# EAGLE design Front-End (EAGLE 8.3.2)

## Sheet 1 of 3
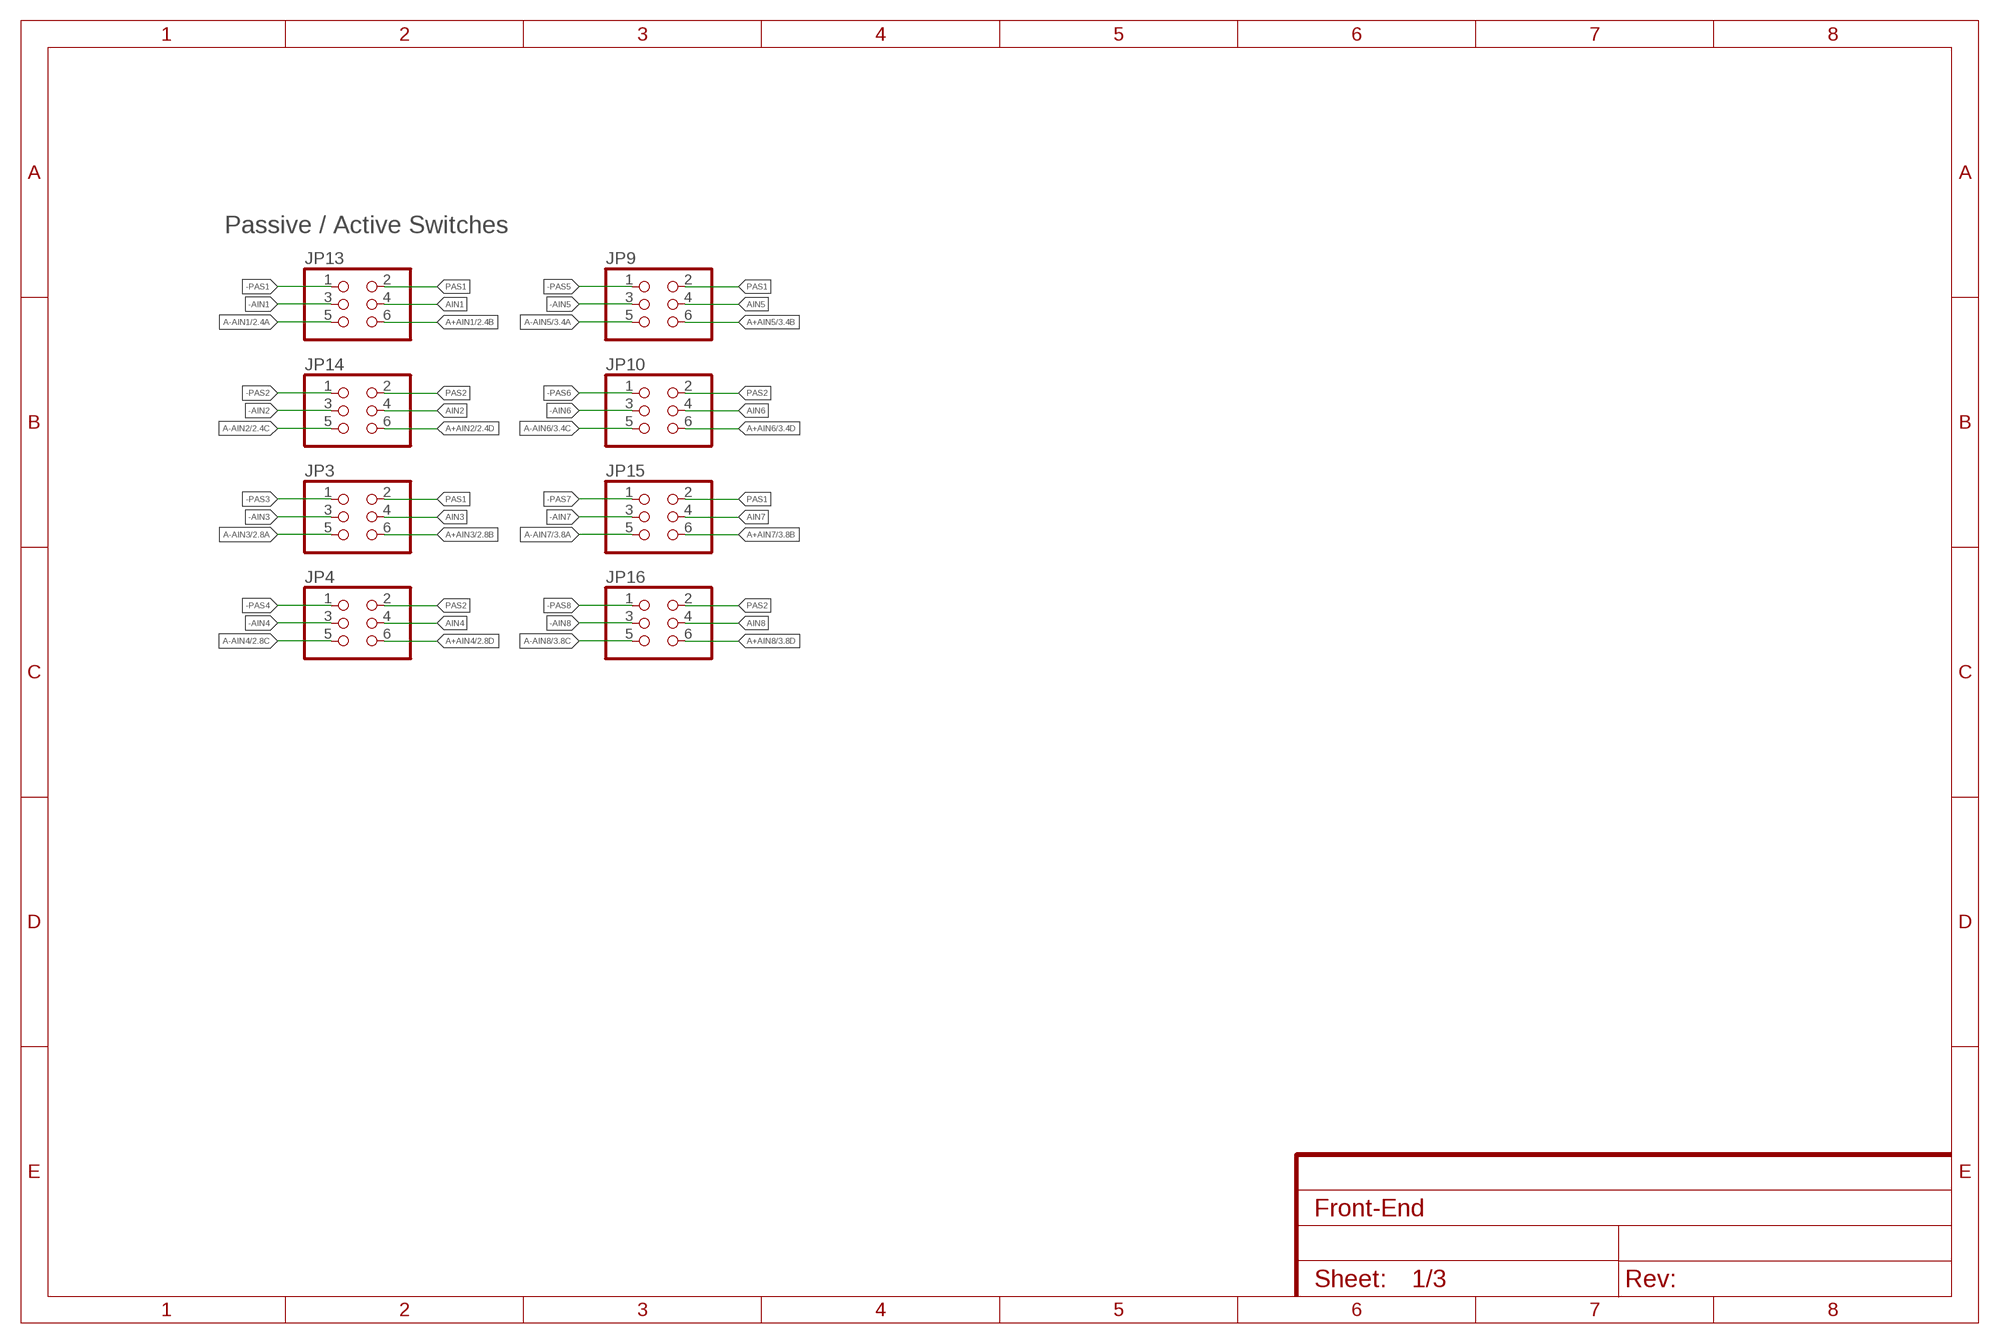
[diagram p0: schematic, sheet 1]

### Parts
JP3  PINHD-2X3  [2X03]
JP4  PINHD-2X3  [2X03]
JP9  PINHD-2X3  [2X03]
JP10  PINHD-2X3  [2X03]
JP13  PINHD-2X3  [2X03]
JP14  PINHD-2X3  [2X03]
JP15  PINHD-2X3  [2X03]
JP16  PINHD-2X3  [2X03]

### Nets
-AIN1: JP13.3
-AIN2: JP14.3
-AIN3: JP3.3
-AIN4: JP4.3
-AIN5: JP9.3
-AIN6: JP10.3
-AIN7: JP15.3
-AIN8: JP16.3
-PAS1: JP13.1 ; also sheet 2
-PAS2: JP14.1 ; also sheet 2
-PAS3: JP3.1 ; also sheet 2
-PAS4: JP4.1 ; also sheet 2
-PAS5: JP9.1 ; also sheet 3
-PAS6: JP10.1 ; also sheet 3
-PAS7: JP15.1 ; also sheet 3
-PAS8: JP16.1 ; also sheet 3
A+AIN1: JP13.6 ; also sheet 2
A+AIN2: JP14.6 ; also sheet 2
A+AIN3: JP3.6 ; also sheet 2
A+AIN4: JP4.6 ; also sheet 2
A+AIN5: JP9.6 ; also sheet 3
A+AIN6: JP10.6 ; also sheet 3
A+AIN7: JP15.6 ; also sheet 3
A+AIN8: JP16.6 ; also sheet 3
A-AIN1: JP13.5 ; also sheet 2
A-AIN2: JP14.5 ; also sheet 2
A-AIN3: JP3.5 ; also sheet 2
A-AIN4: JP4.5 ; also sheet 2
A-AIN5: JP9.5 ; also sheet 3
A-AIN6: JP10.5 ; also sheet 3
A-AIN7: JP15.5 ; also sheet 3
A-AIN8: JP16.5 ; also sheet 3
AIN1: JP13.4
AIN2: JP14.4
AIN3: JP3.4
AIN4: JP4.4
AIN5: JP9.4
AIN6: JP10.4
AIN7: JP15.4
AIN8: JP16.4
PAS1: JP3.2 JP9.2 JP13.2 JP15.2 ; also sheet 2,3
PAS2: JP4.2 JP10.2 JP14.2 JP16.2 ; also sheet 2,3

### Notes on the sheet
- Passive / Active Switches

## Sheet 2 of 3
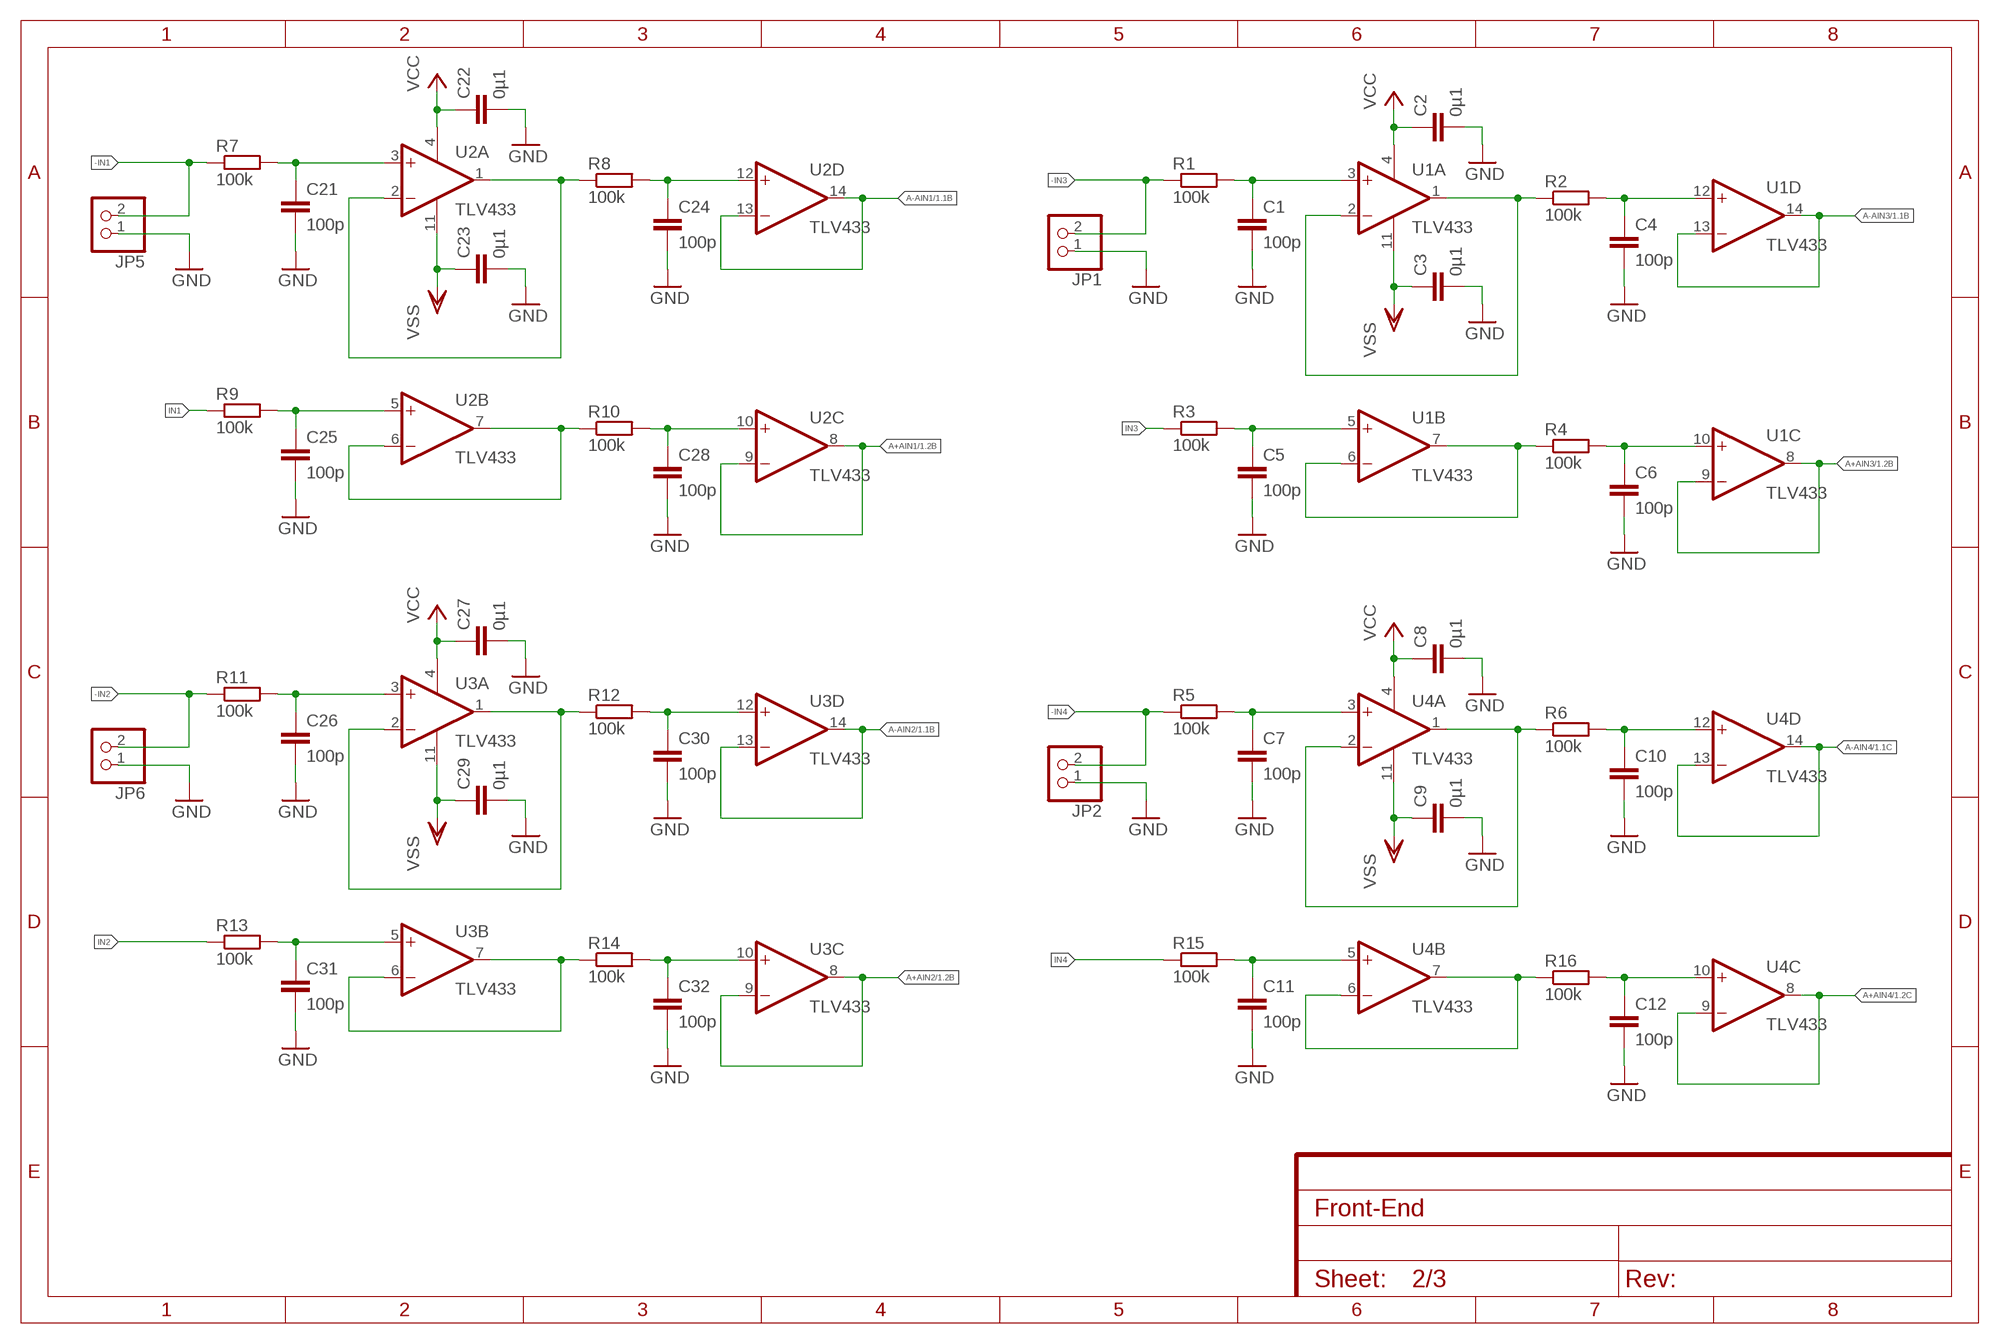
[diagram p1: schematic, sheet 2]

### Parts
C1  100p  C-EUC0603  [C0603]
C2  0µ1  C-EUC0603  [C0603]
C3  0µ1  C-EUC0603  [C0603]
C4  100p  C-EUC0603  [C0603]
C5  100p  C-EUC0603  [C0603]
C6  100p  C-EUC0603  [C0603]
C7  100p  C-EUC0603  [C0603]
C8  0µ1  C-EUC0603  [C0603]
C9  0µ1  C-EUC0603  [C0603]
C10  100p  C-EUC0603  [C0603]
C11  100p  C-EUC0603  [C0603]
C12  100p  C-EUC0603  [C0603]
C21  100p  C-EUC0603  [C0603]
C22  0µ1  C-EUC0603  [C0603]
C23  0µ1  C-EUC0603  [C0603]
C24  100p  C-EUC0603  [C0603]
C25  100p  C-EUC0603  [C0603]
C26  100p  C-EUC0603  [C0603]
C27  0µ1  C-EUC0603  [C0603]
C28  100p  C-EUC0603  [C0603]
C29  0µ1  C-EUC0603  [C0603]
C30  100p  C-EUC0603  [C0603]
C31  100p  C-EUC0603  [C0603]
C32  100p  C-EUC0603  [C0603]
JP1  PINHD-1X2  [1X02]
JP2  PINHD-1X2  [1X02]
JP5  PINHD-1X2  [1X02]
JP6  PINHD-1X2  [1X02]
R1  100k  R-EU_R0603  [R0603]
R2  100k  R-EU_R0603  [R0603]
R3  100k  R-EU_R0603  [R0603]
R4  100k  R-EU_R0603  [R0603]
R5  100k  R-EU_R0603  [R0603]
R6  100k  R-EU_R0603  [R0603]
R7  100k  R-EU_R0603  [R0603]
R8  100k  R-EU_R0603  [R0603]
R9  100k  R-EU_R0603  [R0603]
R10  100k  R-EU_R0603  [R0603]
R11  100k  R-EU_R0603  [R0603]
R12  100k  R-EU_R0603  [R0603]
R13  100k  R-EU_R0603  [R0603]
R14  100k  R-EU_R0603  [R0603]
R15  100k  R-EU_R0603  [R0603]
R16  100k  R-EU_R0603  [R0603]
U1  TLV433  [TSSOP14]
U2  TLV433  [TSSOP14]
U3  TLV433  [TSSOP14]
U4  TLV433  [TSSOP14]

### Nets
-IN1: JP5.2 R7.1
-IN2: JP6.2 R11.1
-IN3: JP1.2 R1.1
-IN4: JP2.2 R5.1
-PAS1: C21.1 R7.2 U2.3(A:+IN) ; also sheet 1
-PAS2: C26.1 R11.2 U3.3(A:+IN) ; also sheet 1
-PAS3: C1.1 R1.2 U1.3(A:+IN) ; also sheet 1
-PAS4: C7.1 R5.2 U4.3(A:+IN) ; also sheet 1
A+AIN1: U2.8(C:OUT) U2.9(C:-IN) ; also sheet 1
A+AIN2: U3.8(C:OUT) U3.9(C:-IN) ; also sheet 1
A+AIN3: U1.8(C:OUT) U1.9(C:-IN) ; also sheet 1
A+AIN4: U4.8(C:OUT) U4.9(C:-IN) ; also sheet 1
A-AIN1: U2.13(D:-IN) U2.14(D:OUT) ; also sheet 1
A-AIN2: U3.13(D:-IN) U3.14(D:OUT) ; also sheet 1
A-AIN3: U1.13(D:-IN) U1.14(D:OUT) ; also sheet 1
A-AIN4: U4.13(D:-IN) U4.14(D:OUT) ; also sheet 1
GND: C1.2 C2.2 C3.2 C4.2 C5.2 C6.2 C7.2 C8.2 C9.2 C10.2 C11.2 C12.2 C21.2 C22.2 C23.2 C24.2 C25.2 C26.2 C27.2 C28.2 C29.2 C30.2 C31.2 C32.2 JP1.1 JP2.1 JP5.1 JP6.1 ; also sheet 3
IN1: R9.1
IN2: R13.1
IN3: R3.1
IN4: R15.1
N$1: C4.1 R2.2 U1.12(D:+IN)
N$2: R2.1 U1.1(A:OUT) U1.2(A:-IN)
N$3: C6.1 R4.2 U1.10(C:+IN)
N$4: C28.1 R10.2 U2.10(C:+IN)
N$5: C24.1 R8.2 U2.12(D:+IN)
N$6: R8.1 U2.1(A:OUT) U2.2(A:-IN)
N$7: R10.1 U2.6(B:-IN) U2.7(B:OUT)
N$8: R4.1 U1.6(B:-IN) U1.7(B:OUT)
N$9: C30.1 R12.2 U3.12(D:+IN)
N$10: R12.1 U3.1(A:OUT) U3.2(A:-IN)
N$11: C10.1 R6.2 U4.12(D:+IN)
N$12: C32.1 R14.2 U3.10(C:+IN)
N$13: R14.1 U3.6(B:-IN) U3.7(B:OUT)
N$206: R6.1 U4.1(A:OUT) U4.2(A:-IN)
N$207: C12.1 R16.2 U4.10(C:+IN)
N$208: R16.1 U4.6(B:-IN) U4.7(B:OUT)
PAS1: C5.1 C25.1 R3.2 R9.2 U1.5(B:+IN) U2.5(B:+IN) ; also sheet 1,3
PAS2: C11.1 C31.1 R13.2 R15.2 U3.5(B:+IN) U4.5(B:+IN) ; also sheet 1,3
VCC: C2.1 C8.1 C22.1 C27.1 U1.4(A:V+) U2.4(A:V+) U3.4(A:V+) U4.4(A:V+) ; also sheet 3
VSS: C3.1 C9.1 C23.1 C29.1 U1.11(A:V-) U2.11(A:V-) U3.11(A:V-) U4.11(A:V-) ; also sheet 3

## Sheet 3 of 3
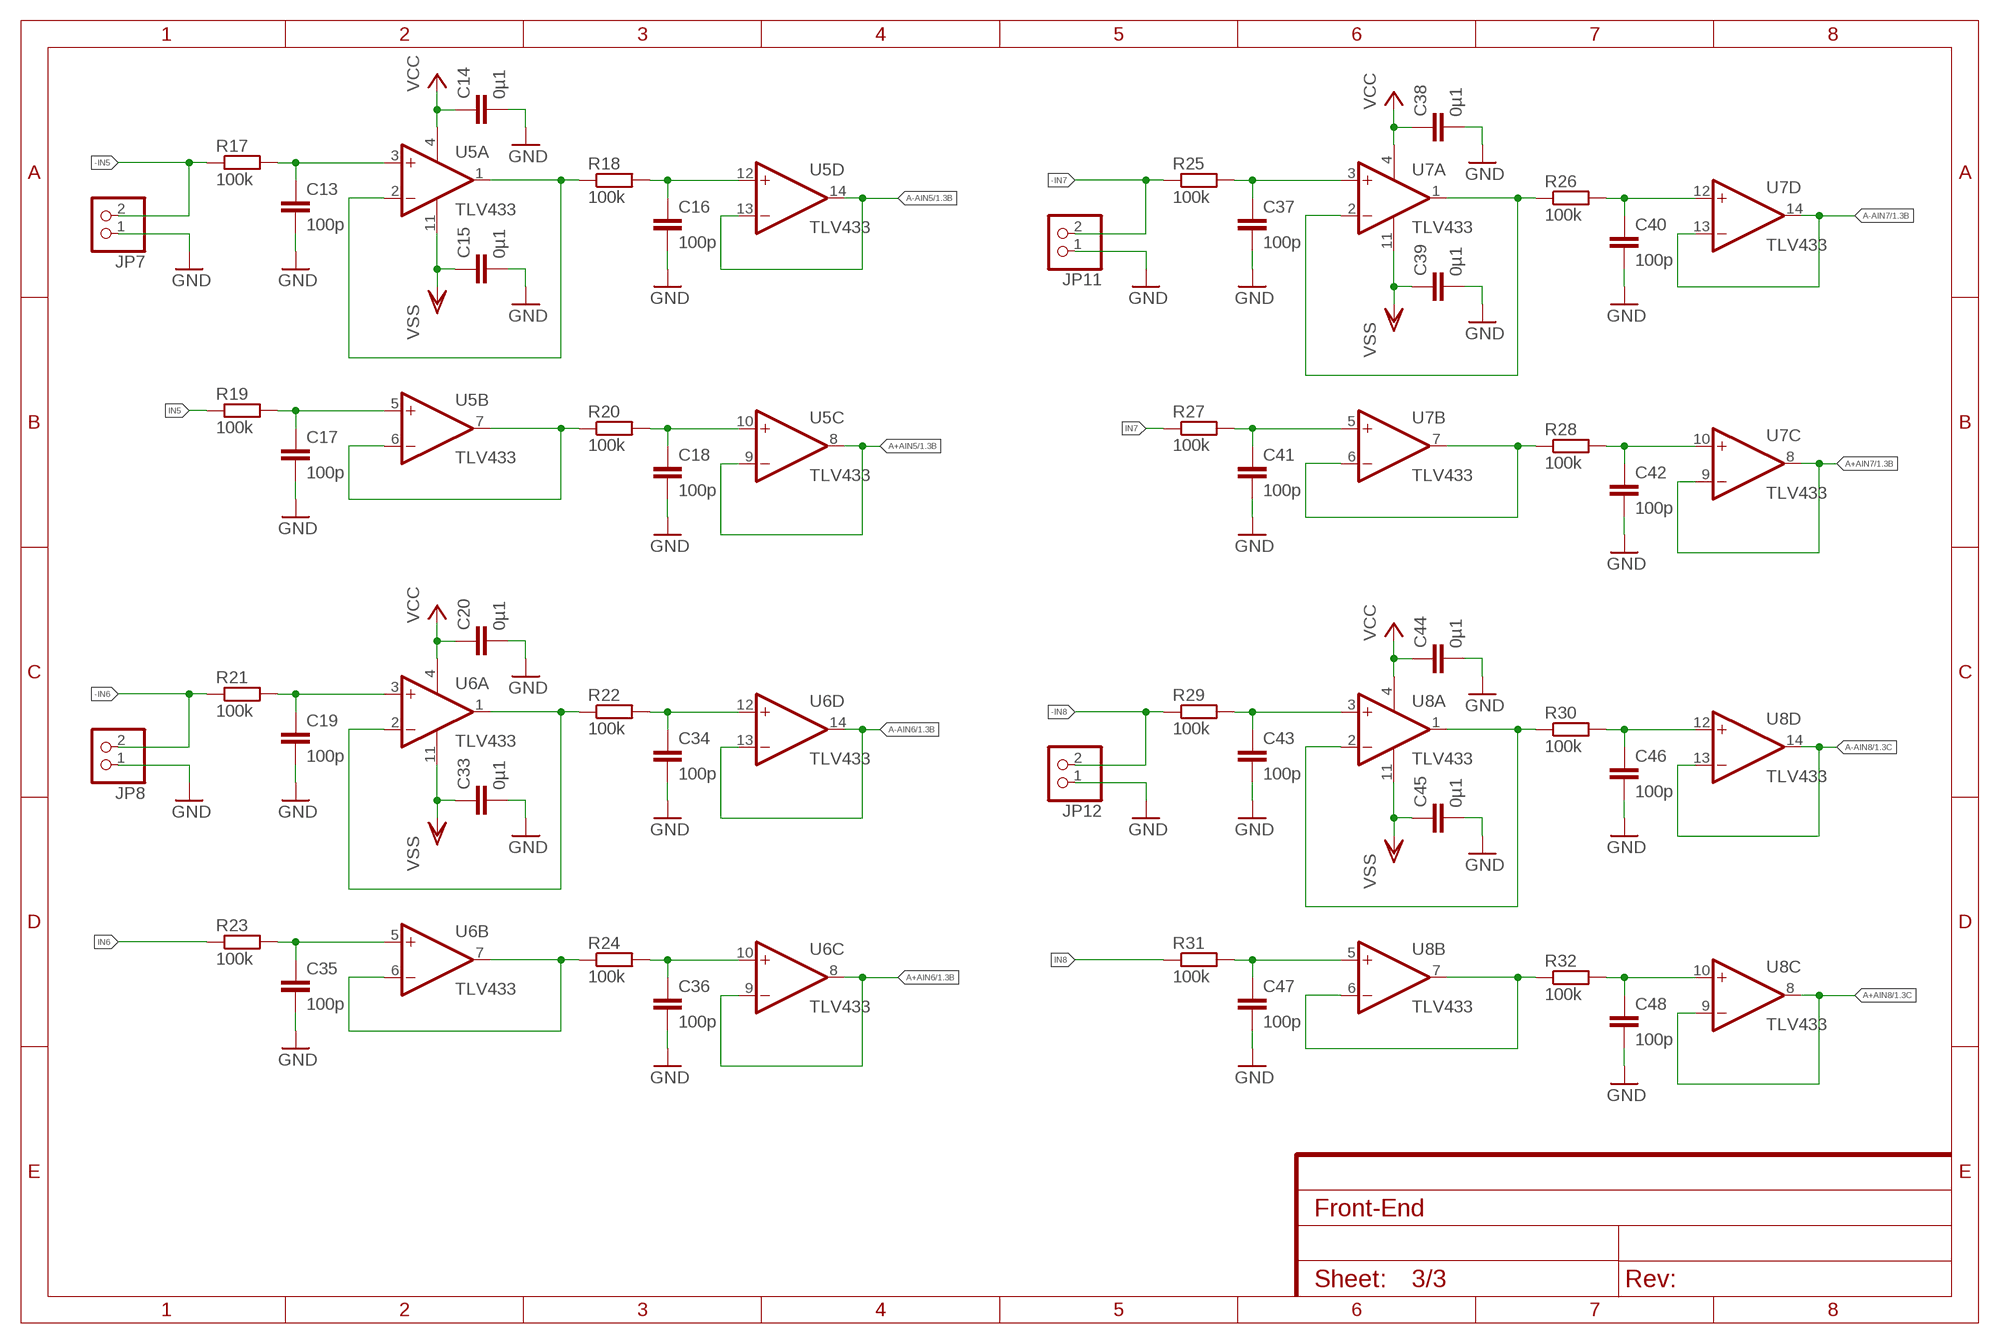
[diagram p2: schematic, sheet 3]

### Parts
C13  100p  C-EUC0603  [C0603]
C14  0µ1  C-EUC0603  [C0603]
C15  0µ1  C-EUC0603  [C0603]
C16  100p  C-EUC0603  [C0603]
C17  100p  C-EUC0603  [C0603]
C18  100p  C-EUC0603  [C0603]
C19  100p  C-EUC0603  [C0603]
C20  0µ1  C-EUC0603  [C0603]
C33  0µ1  C-EUC0603  [C0603]
C34  100p  C-EUC0603  [C0603]
C35  100p  C-EUC0603  [C0603]
C36  100p  C-EUC0603  [C0603]
C37  100p  C-EUC0603  [C0603]
C38  0µ1  C-EUC0603  [C0603]
C39  0µ1  C-EUC0603  [C0603]
C40  100p  C-EUC0603  [C0603]
C41  100p  C-EUC0603  [C0603]
C42  100p  C-EUC0603  [C0603]
C43  100p  C-EUC0603  [C0603]
C44  0µ1  C-EUC0603  [C0603]
C45  0µ1  C-EUC0603  [C0603]
C46  100p  C-EUC0603  [C0603]
C47  100p  C-EUC0603  [C0603]
C48  100p  C-EUC0603  [C0603]
JP7  PINHD-1X2  [1X02]
JP8  PINHD-1X2  [1X02]
JP11  PINHD-1X2  [1X02]
JP12  PINHD-1X2  [1X02]
R17  100k  R-EU_R0603  [R0603]
R18  100k  R-EU_R0603  [R0603]
R19  100k  R-EU_R0603  [R0603]
R20  100k  R-EU_R0603  [R0603]
R21  100k  R-EU_R0603  [R0603]
R22  100k  R-EU_R0603  [R0603]
R23  100k  R-EU_R0603  [R0603]
R24  100k  R-EU_R0603  [R0603]
R25  100k  R-EU_R0603  [R0603]
R26  100k  R-EU_R0603  [R0603]
R27  100k  R-EU_R0603  [R0603]
R28  100k  R-EU_R0603  [R0603]
R29  100k  R-EU_R0603  [R0603]
R30  100k  R-EU_R0603  [R0603]
R31  100k  R-EU_R0603  [R0603]
R32  100k  R-EU_R0603  [R0603]
U5  TLV433  [TSSOP14]
U6  TLV433  [TSSOP14]
U7  TLV433  [TSSOP14]
U8  TLV433  [TSSOP14]

### Nets
-IN5: JP7.2 R17.1
-IN6: JP8.2 R21.1
-IN7: JP11.2 R25.1
-IN8: JP12.2 R29.1
-PAS5: C13.1 R17.2 U5.3(A:+IN) ; also sheet 1
-PAS6: C19.1 R21.2 U6.3(A:+IN) ; also sheet 1
-PAS7: C37.1 R25.2 U7.3(A:+IN) ; also sheet 1
-PAS8: C43.1 R29.2 U8.3(A:+IN) ; also sheet 1
A+AIN5: U5.8(C:OUT) U5.9(C:-IN) ; also sheet 1
A+AIN6: U6.8(C:OUT) U6.9(C:-IN) ; also sheet 1
A+AIN7: U7.8(C:OUT) U7.9(C:-IN) ; also sheet 1
A+AIN8: U8.8(C:OUT) U8.9(C:-IN) ; also sheet 1
A-AIN5: U5.13(D:-IN) U5.14(D:OUT) ; also sheet 1
A-AIN6: U6.13(D:-IN) U6.14(D:OUT) ; also sheet 1
A-AIN7: U7.13(D:-IN) U7.14(D:OUT) ; also sheet 1
A-AIN8: U8.13(D:-IN) U8.14(D:OUT) ; also sheet 1
GND: C13.2 C14.2 C15.2 C16.2 C17.2 C18.2 C19.2 C20.2 C33.2 C34.2 C35.2 C36.2 C37.2 C38.2 C39.2 C40.2 C41.2 C42.2 C43.2 C44.2 C45.2 C46.2 C47.2 C48.2 JP7.1 JP8.1 JP11.1 JP12.1 ; also sheet 2
IN5: R19.1
IN6: R23.1
IN7: R27.1
IN8: R31.1
N$2577: C16.1 R18.2 U5.12(D:+IN)
N$2578: R18.1 U5.1(A:OUT) U5.2(A:-IN)
N$2579: C18.1 R20.2 U5.10(C:+IN)
N$2580: R20.1 U5.6(B:-IN) U5.7(B:OUT)
N$2581: C34.1 R22.2 U6.12(D:+IN)
N$2582: R22.1 U6.1(A:OUT) U6.2(A:-IN)
N$2583: C36.1 R24.2 U6.10(C:+IN)
N$2584: R24.1 U6.6(B:-IN) U6.7(B:OUT)
N$2585: C40.1 R26.2 U7.12(D:+IN)
N$2586: R26.1 U7.1(A:OUT) U7.2(A:-IN)
N$2587: C42.1 R28.2 U7.10(C:+IN)
N$2588: R28.1 U7.6(B:-IN) U7.7(B:OUT)
N$2589: C46.1 R30.2 U8.12(D:+IN)
N$2590: R30.1 U8.1(A:OUT) U8.2(A:-IN)
N$2591: C48.1 R32.2 U8.10(C:+IN)
N$2592: R32.1 U8.6(B:-IN) U8.7(B:OUT)
PAS1: C17.1 C41.1 R19.2 R27.2 U5.5(B:+IN) U7.5(B:+IN) ; also sheet 1,2
PAS2: C35.1 C47.1 R23.2 R31.2 U6.5(B:+IN) U8.5(B:+IN) ; also sheet 1,2
VCC: C14.1 C20.1 C38.1 C44.1 U5.4(A:V+) U6.4(A:V+) U7.4(A:V+) U8.4(A:V+) ; also sheet 2
VSS: C15.1 C33.1 C39.1 C45.1 U5.11(A:V-) U6.11(A:V-) U7.11(A:V-) U8.11(A:V-) ; also sheet 2

## Library data of the parts
C1-C48 = resistor:C-EU: CAPACITOR, European symbol
JP1 JP2 JP5-JP8 JP11 JP12 = pinhead:PINHD-1X2: PIN HEADER
JP3 JP4 JP9 JP10 JP13-JP16 = pinhead:PINHD-2X3: PIN HEADER
R1-R32 = resistor:R-EU_: RESISTOR, European symbol
U1-U8 = opamp-custom:TLV433

## Board
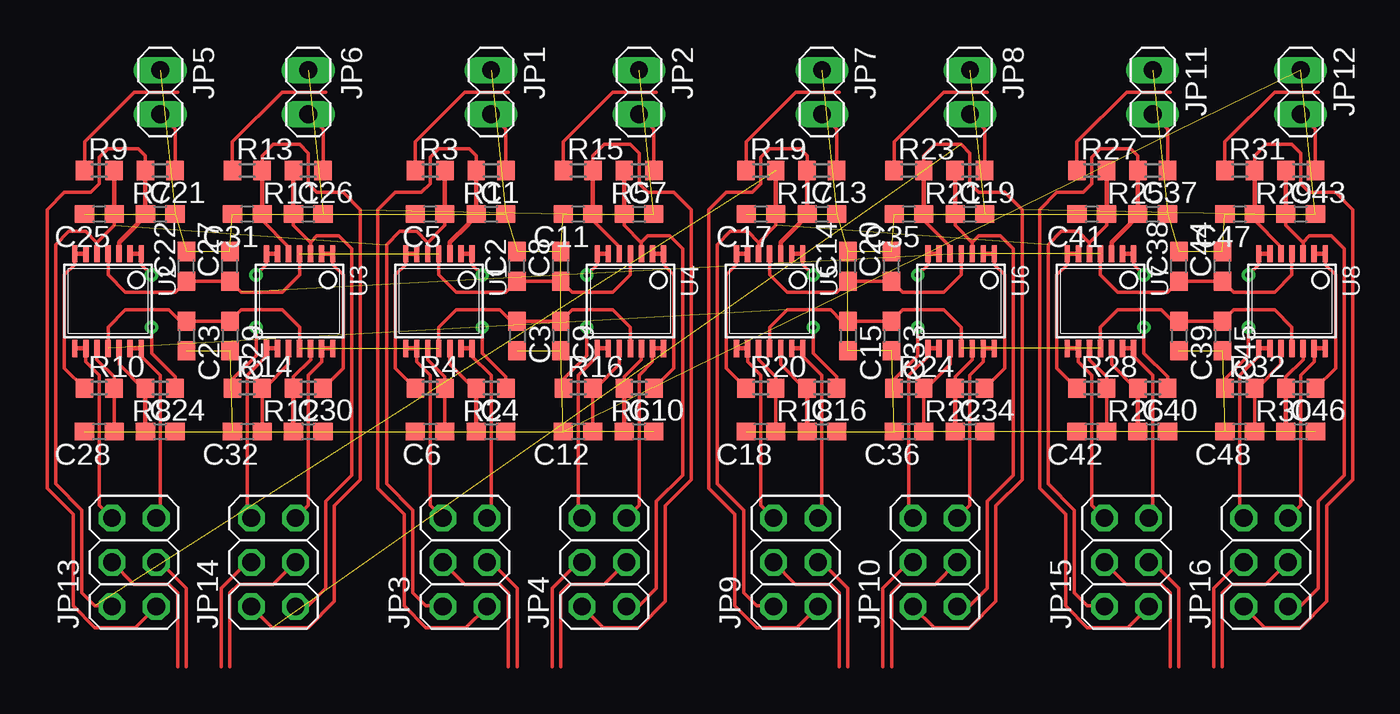
[diagram p3: board, top side]
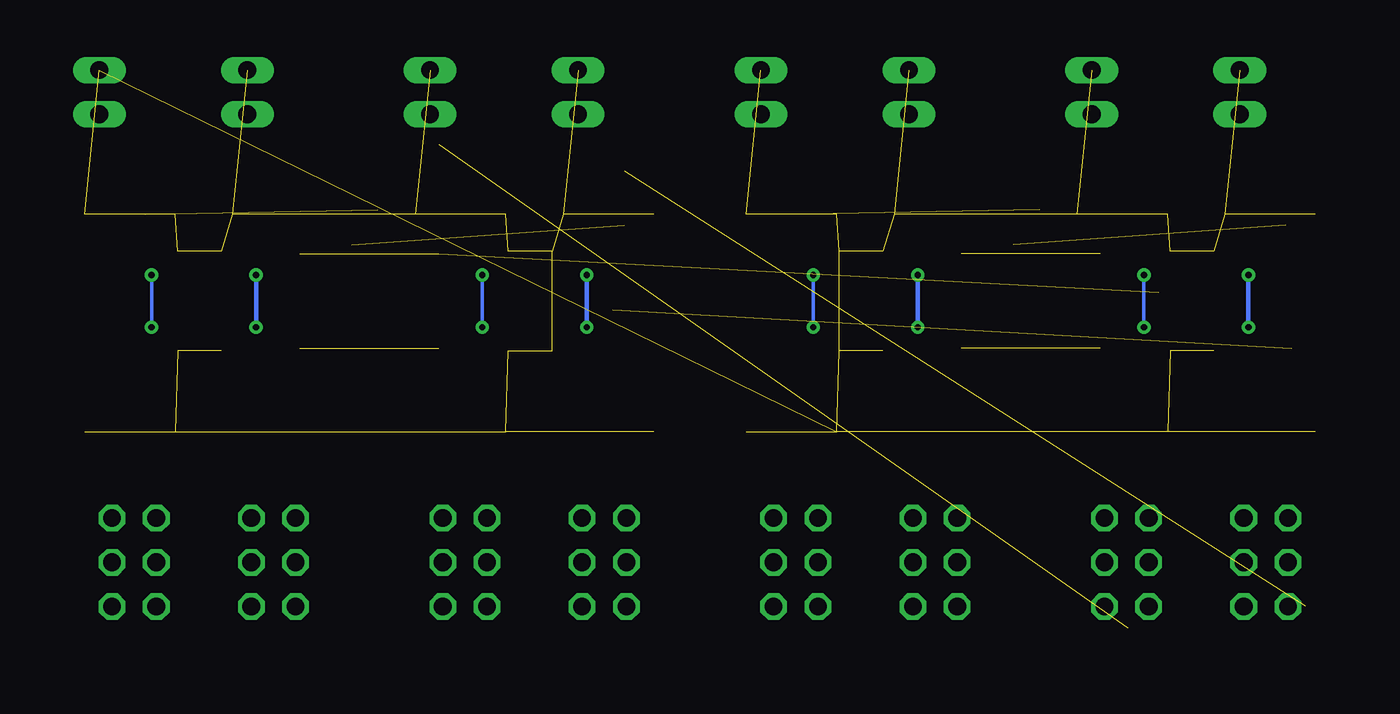
[diagram p4: board, bottom side, seen from below]

No outline drawn. Coordinates in mm, seen from the top.
Copper layers (1*16): Top 0.035mm / dielectric 1.5mm / Bottom 0.035mm
Design rules "default": minimum track width 6mil, minimum drill 0.35mm, track to track 6mil, track to pad 6mil, pad to pad 6mil, via to via 6mil, smd to smd 6mil, copper to edge 40mil, drill to drill 6mil, minimum pad ring 10mil, minimum via ring 8mil, stop-mask expansion 4mil, vias tented up to drill 0mil, thermal gap 10mil

### Footprints (pad centres in the part's own frame; a part is rotated, then mirrored left to right if it is on the bottom)
C0603 = smd 1.1 x 1: 1 -0.85,0; 2 0.85,0
1X02 = drill 1.016 long: 1 -1.27,0; 2 1.27,0
2X03 = drill 1.016 octagon: 1 -2.54,-1.27; 2 -2.54,1.27; 3 0,-1.27; 4 0,1.27; 5 2.54,-1.27; 6 2.54,1.27
R0603 = smd 1 x 1.1: 1 -0.85,0; 2 0.85,0
TSSOP14 = smd 0.305 x 0.991: 1 -1.905,-2.718; 2 -1.27,-2.718; 3 -0.635,-2.718; 4 0,-2.718; 5 0.635,-2.718; 6 1.27,-2.718; 7 1.905,-2.718; 8 1.905,2.718; 9 1.27,2.718; 10 0.635,2.718; 11 0,2.718; 12 -0.635,2.718; 13 -1.27,2.718; 14 -1.905,2.718

### Placement (x,y rotation side)
C1  27,27 0 top
C2  28.5,24 90 top
C3  28.5,20 270 top
C4  27,14.5 0 top
C5  23.5,27 180 top
C6  23.5,14.5 180 top
C7  35.5,27 0 top
C8  31,24 90 top
C9  31,20 270 top
C10  35.5,14.5 0 top
C11  32,27 180 top
C12  32,14.5 180 top
C13  46,27 0 top
C14  47.5,24 90 top
C15  47.5,20 270 top
C16  46,14.5 0 top
C17  42.5,27 180 top
C18  42.5,14.5 180 top
C19  54.5,27 0 top
C20  50,24 90 top
C21  8,27 0 top
C22  9.5,24 90 top
C23  9.5,20 270 top
C24  8,14.5 0 top
C25  4.5,27 180 top
C26  16.5,27 0 top
C27  12,24 90 top
C28  4.5,14.5 180 top
C29  12,20 270 top
C30  16.5,14.5 0 top
C31  13,27 180 top
C32  13,14.5 180 top
C33  50,20 270 top
C34  54.5,14.5 0 top
C35  51,27 180 top
C36  51,14.5 180 top
C37  65,27 0 top
C38  66.5,24 90 top
C39  66.5,20 270 top
C40  65,14.5 0 top
C41  61.5,27 180 top
C42  61.5,14.5 180 top
C43  73.5,27 0 top
C44  69,24 90 top
C45  69,20 270 top
C46  73.5,14.5 0 top
C47  70,27 180 top
C48  70,14.5 180 top
JP1  27,34 270 top
JP2  35.5,34 270 top
JP3  25.5,7 90 top
JP4  33.5,7 90 top
JP5  8,34 270 top
JP6  16.5,34 270 top
JP7  46,34 270 top
JP8  54.5,34 270 top
JP9  44.5,7 90 top
JP10  52.5,7 90 top
JP11  65,34 270 top
JP12  73.5,34 270 top
JP13  6.5,7 90 top
JP14  14.5,7 90 top
JP15  63.5,7 90 top
JP16  71.5,7 90 top
R1  27,29.5 180 top
R2  27,17 180 top
R3  23.5,29.5 0 top
R4  23.5,17 0 top
R5  35.5,29.5 180 top
R6  35.5,17 180 top
R7  8,29.5 180 top
R8  8,17 180 top
R9  4.5,29.5 0 top
R10  4.5,17 0 top
R11  16.5,29.5 180 top
R12  16.5,17 180 top
R13  13,29.5 0 top
R14  13,17 0 top
R15  32,29.5 0 top
R16  32,17 0 top
R17  46,29.5 180 top
R18  46,17 180 top
R19  42.5,29.5 0 top
R20  42.5,17 0 top
R21  54.5,29.5 180 top
R22  54.5,17 180 top
R23  51,29.5 0 top
R24  51,17 0 top
R25  65,29.5 180 top
R26  65,17 180 top
R27  61.5,29.5 0 top
R28  61.5,17 0 top
R29  73.5,29.5 180 top
R30  73.5,17 180 top
R31  70,29.5 0 top
R32  70,17 0 top
U1  24,22 180 top
U2  5,22 180 top
U3  16,22 180 top
U4  35,22 180 top
U5  43,22 180 top
U6  54,22 180 top
U7  62,22 180 top
U8  73,22 180 top

### Tracks (layer width: path | path; a pad name or v marks a point on that pad's centre or on a via)
-AIN1
  Top 0.203: JP13.3 8,7 9.5,5.5 9.5,1
-AIN2
  Top 0.203: JP14.3 15.75,7 14.5,5.75 12.5,5.75 12,5.25 12,1
-AIN3
  Top 0.203: JP3.3 27,7 28.5,5.5 28.5,1
-AIN4
  Top 0.203: JP4.3 34.75,7 33.5,5.75 31.5,5.75 31,5.25 31,1
-AIN5
  Top 0.203: JP9.3 46,7 47.5,5.5 47.5,1
-AIN6
  Top 0.203: JP10.3 53.75,7 52.5,5.75 50.5,5.75 50,5.25 50,1
-AIN7
  Top 0.203: JP15.3 65,7 66.5,5.5 66.5,1
-AIN8
  Top 0.203: JP16.3 72.75,7 71.5,5.75 69.5,5.75 69,5.25 69,1
-IN1
  Top 0.203: R7.1 8.85,31.88 JP5.2
-IN2
  Top 0.203: R11.1 17.35,31.88 JP6.2
-IN3
  Top 0.203: R1.1 27.85,31.88 JP1.2
-IN4
  Top 0.203: R5.1 36.35,31.88 JP2.2
-IN5
  Top 0.203: R17.1 46.85,31.88 JP7.2
-IN6
  Top 0.203: R21.1 55.35,31.88 JP8.2
-IN7
  Top 0.203: R25.1 65.85,31.88 JP11.2
-IN8
  Top 0.203: R29.1 74.35,31.88 JP12.2
-PAS1
  Top 0.203: R7.2 7.15,30.35 6.75,30.75 5,30.75 4.5,30.25 4.5,28.75 4,28.25 2.5,28.25 1.5,27.25 1.5,11.25 3,9.75 3,4.5 4.25,3.25 6.56,3.25 JP13.1
  Top 0.254: U2.3 5.63,25.39 6.65,26.4 C21.1 R7.2
-PAS2
  Top 0.203: U3.3 16.64,25.36 | C26.1 15.65,26.35 16.64,25.36 | 16.64,25.36 16.64,25.39 17,25.75 18.25,25.75 19,25 19,12 17.5,10.5 17.5,5.5 16.5,4.5 15.81,4.5 JP14.1
  Top 0.254: C26.1 R11.2
-PAS3
  Top 0.203: R1.2 26.15,30.35 25.75,30.75 24,30.75 23.5,30.25 23.5,28.75 23,28.25 21.5,28.25 20.5,27.25 20.5,11.25 22,9.75 22,4.5 23.25,3.25 25.56,3.25 JP3.1
  Top 0.254: U1.3 24.64,25.39 25.65,26.4 C1.1 R1.2
-PAS4
  Top 0.203: U4.3 35.63,25.36 | C7.1 34.65,26.35 35.63,25.36 | 35.63,25.36 35.63,25.39 36,25.75 37.25,25.75 38,25 38,12 36.5,10.5 36.5,5.5 35.5,4.5 34.81,4.5 JP4.1
  Top 0.254: C7.1 R5.2
-PAS5
  Top 0.203: R17.2 45.15,30.35 44.75,30.75 43,30.75 42.5,30.25 42.5,28.75 42,28.25 40.5,28.25 39.5,27.25 39.5,11.25 41,9.75 41,4.5 42.25,3.25 44.56,3.25 JP9.1
  Top 0.254: U5.3 43.63,25.39 44.65,26.4 C13.1 R17.2
-PAS6
  Top 0.203: U6.3 54.63,25.36 | C19.1 53.65,26.35 54.63,25.36 | 54.63,25.36 54.63,25.39 55,25.75 56.25,25.75 57,25 57,12 55.5,10.5 55.5,5.5 54.5,4.5 53.81,4.5 JP10.1
  Top 0.254: C19.1 R21.2
-PAS7
  Top 0.203: R25.2 64.15,30.35 63.75,30.75 62,30.75 61.5,30.25 61.5,28.75 61,28.25 59.5,28.25 58.5,27.25 58.5,11.25 60,9.75 60,4.5 61.25,3.25 63.56,3.25 JP15.1
  Top 0.254: U7.3 62.63,25.39 63.65,26.4 C37.1 R25.2
-PAS8
  Top 0.203: U8.3 73.64,25.36 | C43.1 72.65,26.35 73.64,25.36 | 73.64,25.36 73.64,25.39 74,25.75 75.25,25.75 76,25 76,12 74.5,10.5 74.5,5.5 73.5,4.5 72.81,4.5 JP16.1
  Top 0.254: C43.1 R29.2
A+AIN1
  Top 0.203: U2.9 3.73,18.52 4.5,17.75 4.5,10.27 JP13.6
  Top 0.254: U2.8 U2.9
A+AIN2
  Top 0.203: U3.8 14.1,18.84 13,17.75 13,9.77 JP14.6
  Top 0.254: U3.9 U3.8
A+AIN3
  Top 0.203: U1.9 22.73,18.52 23.5,17.75 23.5,10.27 JP3.6
  Top 0.254: U1.8 U1.9
A+AIN4
  Top 0.203: U4.8 33.09,18.84 32,17.75 32,9.77 JP4.6
  Top 0.254: U4.9 U4.8
A+AIN5
  Top 0.203: U5.9 41.73,18.52 42.5,17.75 42.5,10.27 JP9.6
  Top 0.254: U5.8 U5.9
A+AIN6
  Top 0.203: U6.8 52.09,18.84 51,17.75 51,9.77 JP10.6
  Top 0.254: U6.9 U6.8
A+AIN7
  Top 0.203: U7.9 60.73,18.52 61.5,17.75 61.5,10.27 JP15.6
  Top 0.254: U7.8 U7.9
A+AIN8
  Top 0.203: U8.8 71.09,18.84 70,17.75 70,9.77 JP16.6
  Top 0.254: U8.9 U8.8
A-AIN1
  Top 0.203: U2.14 6.91,18.84 8,17.75 8,9.77 JP13.5
  Top 0.254: U2.13 U2.14
A-AIN2
  Top 0.203: U3.13 17.27,18.52 16.5,17.75 16.5,10.27 JP14.5
  Top 0.254: U3.14 U3.13
A-AIN3
  Top 0.203: U1.14 25.91,18.84 27,17.75 27,9.77 JP3.5
  Top 0.254: U1.13 U1.14
A-AIN4
  Top 0.203: U4.13 36.27,18.52 35.5,17.75 35.5,10.27 JP4.5
  Top 0.254: U4.14 U4.13
A-AIN5
  Top 0.203: U5.14 44.91,18.84 46,17.75 46,9.77 JP9.5
  Top 0.254: U5.13 U5.14
A-AIN6
  Top 0.203: U6.13 55.27,18.52 54.5,17.75 54.5,10.27 JP10.5
  Top 0.254: U6.14 U6.13
A-AIN7
  Top 0.203: U7.14 63.91,18.84 65,17.75 65,9.77 JP15.5
  Top 0.254: U7.13 U7.14
A-AIN8
  Top 0.203: U8.13 74.27,18.52 73.5,17.75 73.5,10.27 JP16.5
  Top 0.254: U8.14 U8.13
AIN1
  Top 0.203: JP13.4 6.48,5.75 8.5,5.75 9,5.25 9,1
AIN2
  Top 0.203: JP14.4 13,7 11.5,5.5 11.5,1
AIN3
  Top 0.203: JP3.4 25.48,5.75 27.5,5.75 28,5.25 28,1
AIN4
  Top 0.203: JP4.4 32,7 30.5,5.5 30.5,1
AIN5
  Top 0.203: JP9.4 44.48,5.75 46.5,5.75 47,5.25 47,1
AIN6
  Top 0.203: JP10.4 51,7 49.5,5.5 49.5,1
AIN7
  Top 0.203: JP15.4 63.48,5.75 65.5,5.75 66,5.25 66,1
AIN8
  Top 0.203: JP16.4 70,7 68.5,5.5 68.5,1
GND  (55 unrouted)
IN1
  Top 0.203: R9.1 3.65,31.15 6.5,34 9,34
IN2
  Top 0.203: R13.1 12.15,31.15 15,34 17.5,34
IN3
  Top 0.203: R3.1 22.65,31.15 25.5,34 28,34
IN4
  Top 0.203: R15.1 31.15,31.15 34,34 36.5,34
IN5
  Top 0.203: R19.1 41.65,31.15 44.5,34 47,34
IN6
  Top 0.203: R23.1 50.15,31.15 53,34 55.5,34
IN7
  Top 0.203: R27.1 60.65,31.15 63.5,34 66,34
IN8
  Top 0.203: R31.1 69.15,31.15 72,34 74.5,34
N$1
  Top 0.203: U1.12 24.64,18.36 26,17 R2.2
  Top 0.254: R2.2 C4.1
N$2  (via drill 0.35)
  Top 0.203: R2.1 27.85,17.65 26.5,19 v26.5,20.5 | U1.1 25.91,24.09 v26.5,23.5
  Top 0.254: U1.2 U1.1 25.91,24.34
  Bottom 0.254: v26.5,20.5 v26.5,23.5
N$3
  Top 0.203: C6.1 R4.2 24.35,17.65 23.36,18.64 U1.10
N$4
  Top 0.203: C28.1 R10.2 5.35,17.65 4.37,18.64 U2.10
N$5
  Top 0.203: U2.12 5.63,18.36 7,17 R8.2
  Top 0.254: R8.2 C24.1
N$6  (via drill 0.35)
  Top 0.203: R8.1 8.85,17.65 7.5,19 v7.5,20.5 | U2.1 6.91,24.09 v7.5,23.5
  Top 0.254: U2.2 U2.1 6.91,24.34
  Bottom 0.254: v7.5,20.5 v7.5,23.5
N$7
  Top 0.203: U2.7 3.1,24.09 2.5,23.5 2.5,18.15 R10.1
  Top 0.254: U2.6 U2.7
N$8
  Top 0.203: U1.7 22.09,24.09 21.5,23.5 21.5,18.15 R4.1
  Top 0.254: U1.6 U1.7
N$9
  Top 0.203: U3.12 16.64,18.64 15.65,17.65 R12.2
  Top 0.254: R12.2 C30.1
N$10
  Top 0.203: R12.1 18.5,18.15 18.5,23.5 17.91,24.09 U3.1
  Top 0.254: U3.1 U3.2
N$11
  Top 0.203: U4.12 35.63,18.64 34.65,17.65 R6.2
  Top 0.254: R6.2 C10.1
N$12
  Top 0.203: U3.10 15.37,18.36 14,17 R14.2 C32.1
N$13  (via drill 0.35)
  Top 0.203: v13.5,23.5 14.1,24.09 U3.7 | v13.5,20.5 13.5,18.85 12.15,17.5 R14.1
  Top 0.254: U3.7 U3.6
  Bottom 0.203: v13.5,20.5 v13.5,23.5
N$206
  Top 0.203: R6.1 37.5,18.15 37.5,23.5 36.91,24.09 U4.1
  Top 0.254: U4.1 U4.2
N$207
  Top 0.203: U4.10 34.37,18.36 33,17 R16.2 C12.1
N$208  (via drill 0.35)
  Top 0.203: v32.5,23.5 33.09,24.09 U4.7 | v32.5,20.5 32.5,18.85 31.15,17.5 R16.1
  Top 0.254: U4.7 U4.6
  Bottom 0.203: v32.5,20.5 v32.5,23.5
N$2577
  Top 0.203: U5.12 43.63,18.36 45,17 R18.2
  Top 0.254: R18.2 C16.1
N$2578  (via drill 0.35)
  Top 0.203: R18.1 46.85,17.65 45.5,19 v45.5,20.5 | U5.1 44.91,24.09 v45.5,23.5
  Top 0.254: U5.2 U5.1 44.91,24.34
  Bottom 0.254: v45.5,20.5 v45.5,23.5
N$2579
  Top 0.203: C18.1 R20.2 43.35,17.65 42.37,18.64 U5.10
N$2580
  Top 0.203: U5.7 41.09,24.09 40.5,23.5 40.5,18.15 R20.1
  Top 0.254: U5.6 U5.7
N$2581
  Top 0.203: U6.12 54.63,18.64 53.65,17.65 R22.2
  Top 0.254: R22.2 C34.1
N$2582
  Top 0.203: R22.1 56.5,18.15 56.5,23.5 55.91,24.09 U6.1
  Top 0.254: U6.1 U6.2
N$2583
  Top 0.203: U6.10 53.37,18.36 52,17 R24.2 C36.1
N$2584  (via drill 0.35)
  Top 0.203: v51.5,23.5 52.09,24.09 U6.7 | v51.5,20.5 51.5,18.85 50.15,17.5 R24.1
  Top 0.254: U6.7 U6.6
  Bottom 0.203: v51.5,20.5 v51.5,23.5
N$2585
  Top 0.203: U7.12 62.63,18.36 64,17 R26.2
  Top 0.254: R26.2 C40.1
N$2586  (via drill 0.35)
  Top 0.203: R26.1 65.85,17.65 64.5,19 v64.5,20.5 | U7.1 63.91,24.09 v64.5,23.5
  Top 0.254: U7.2 U7.1 63.91,24.34
  Bottom 0.254: v64.5,20.5 v64.5,23.5
N$2587
  Top 0.203: C42.1 R28.2 62.35,17.65 61.37,18.64 U7.10
N$2588
  Top 0.203: U7.7 60.09,24.09 59.5,23.5 59.5,18.15 R28.1
  Top 0.254: U7.6 U7.7
N$2589
  Top 0.203: U8.12 73.64,18.64 72.65,17.65 R30.2
  Top 0.254: R30.2 C46.1
N$2590
  Top 0.203: R30.1 75.5,18.15 75.5,23.5 74.91,24.09 U8.1
  Top 0.254: U8.1 U8.2
N$2591
  Top 0.203: U8.10 72.36,18.36 71,17 R32.2 C48.1
N$2592  (via drill 0.35)
  Top 0.203: v70.5,23.5 71.09,24.09 U8.7 | v70.5,20.5 70.5,18.85 69.15,17.5 R32.1
  Top 0.254: U8.7 U8.6
  Bottom 0.203: v70.5,20.5 v70.5,23.5
PAS1  (3 unrouted)
  Top 0.203: C25.1 5.35,26.35 4.37,25.36 | 4.37,25.36 U2.5 | 4.37,25.36 3.73,26 2.75,26 2,25.25 2,11.5 3.5,10 3.5,5.25 4.25,4.5 5.19,4.5 JP13.2 | C5.1 24.35,26.35 23.36,25.36 | 23.36,25.36 U1.5 | 23.36,25.36 22.73,26 21.75,26 21,25.25 21,11.5 22.5,10 22.5,5.25 23.25,4.5 24.19,4.5 JP3.2 | C17.1 43.35,26.35 42.37,25.36 | 42.37,25.36 U5.5 | 42.37,25.36 41.73,26 40.75,26 40,25.25 40,11.5 41.5,10 41.5,5.25 42.25,4.5 43.19,4.5 JP9.2 | C41.1 62.35,26.35 61.37,25.36 | 61.37,25.36 U7.5 | 61.37,25.36 60.73,26 59.75,26 59,25.25 59,11.5 60.5,10 60.5,5.25 61.25,4.5 62.19,4.5 JP15.2
  Top 0.254: R9.2 C25.1 | R3.2 C5.1 | R19.2 C17.1 | R27.2 C41.1
PAS2  (3 unrouted)
  Top 0.203: C31.1 13.85,26.65 15.37,25.14 U3.5 | R13.2 13.85,30.35 14.5,31 16,31 16.5,30.5 16.5,28.75 17,28.25 18.5,28.25 19.5,27.25 19.5,11.75 18,10.25 18,4.75 16.5,3.25 14.44,3.25 JP14.2 | C11.1 32.85,26.65 34.37,25.14 U4.5 | R15.2 32.85,30.35 33.5,31 35,31 35.5,30.5 35.5,28.75 36,28.25 37.5,28.25 38.5,27.25 38.5,11.75 37,10.25 37,4.75 35.5,3.25 33.44,3.25 JP4.2 | C35.1 51.85,26.65 53.37,25.14 U6.5 | R23.2 51.85,30.35 52.5,31 54,31 54.5,30.5 54.5,28.75 55,28.25 56.5,28.25 57.5,27.25 57.5,11.75 56,10.25 56,4.75 54.5,3.25 52.44,3.25 JP10.2 | C47.1 70.85,26.65 72.36,25.14 U8.5 | R31.2 70.85,30.35 71.5,31 73,31 73.5,30.5 73.5,28.75 74,28.25 75.5,28.25 76.5,27.25 76.5,11.75 75,10.25 75,4.75 73.5,3.25 71.44,3.25 JP16.2
  Top 0.254: C31.1 R13.2 | C11.1 R15.2 | C35.1 R23.2 | C47.1 R31.2
VCC  (3 unrouted)
  Top 0.203: U3.4 16,23.5 15,22.5 12.65,22.5 C27.1 C22.1 8.85,22.5 6,22.5 5,23.5 U2.4 | U4.4 35,23.5 34,22.5 31.65,22.5 C8.1 C2.1 27.85,22.5 25,22.5 24,23.5 U1.4 | U6.4 54,23.5 53,22.5 50.65,22.5 C20.1 C14.1 46.85,22.5 44,22.5 43,23.5 U5.4 | U8.4 73,23.5 72,22.5 69.65,22.5 C44.1 C38.1 65.85,22.5 63,22.5 62,23.5 U7.4
VSS  (3 unrouted)
  Top 0.203: U3.11 16,20.5 15,21.5 12.65,21.5 C29.1 C23.1 9.15,20.85 8.5,21.5 6,21.5 5,20.5 U2.11 | U4.11 35,20.5 34,21.5 31.65,21.5 C9.1 C3.1 28.15,20.85 27.5,21.5 25,21.5 24,20.5 U1.11 | U6.11 54,20.5 53,21.5 50.65,21.5 C33.1 C15.1 47.15,20.85 46.5,21.5 44,21.5 43,20.5 U5.11 | U8.11 73,20.5 72,21.5 69.65,21.5 C45.1 C39.1 66.15,20.85 65.5,21.5 63,21.5 62,20.5 U7.11

### Text on the board
tDocu: CH1 | CH2 | CH3 | CH4 | CH5 | CH6 | CH7 | CH8 | SINGLE / ENDED | SINGLE / ENDED | SINGLE / ENDED | SINGLE / ENDED | SINGLE / ENDED | SINGLE / ENDED | SINGLE / ENDED | SINGLE / ENDED | PASSIVE | PASSIVE | PASSIVE | PASSIVE | PASSIVE | PASSIVE | PASSIVE | PASSIVE | ACTIVE | ACTIVE | ACTIVE | ACTIVE | ACTIVE | ACTIVE | ACTIVE | ACTIVE